# EAGLE design simple (EAGLE 9.0.0)
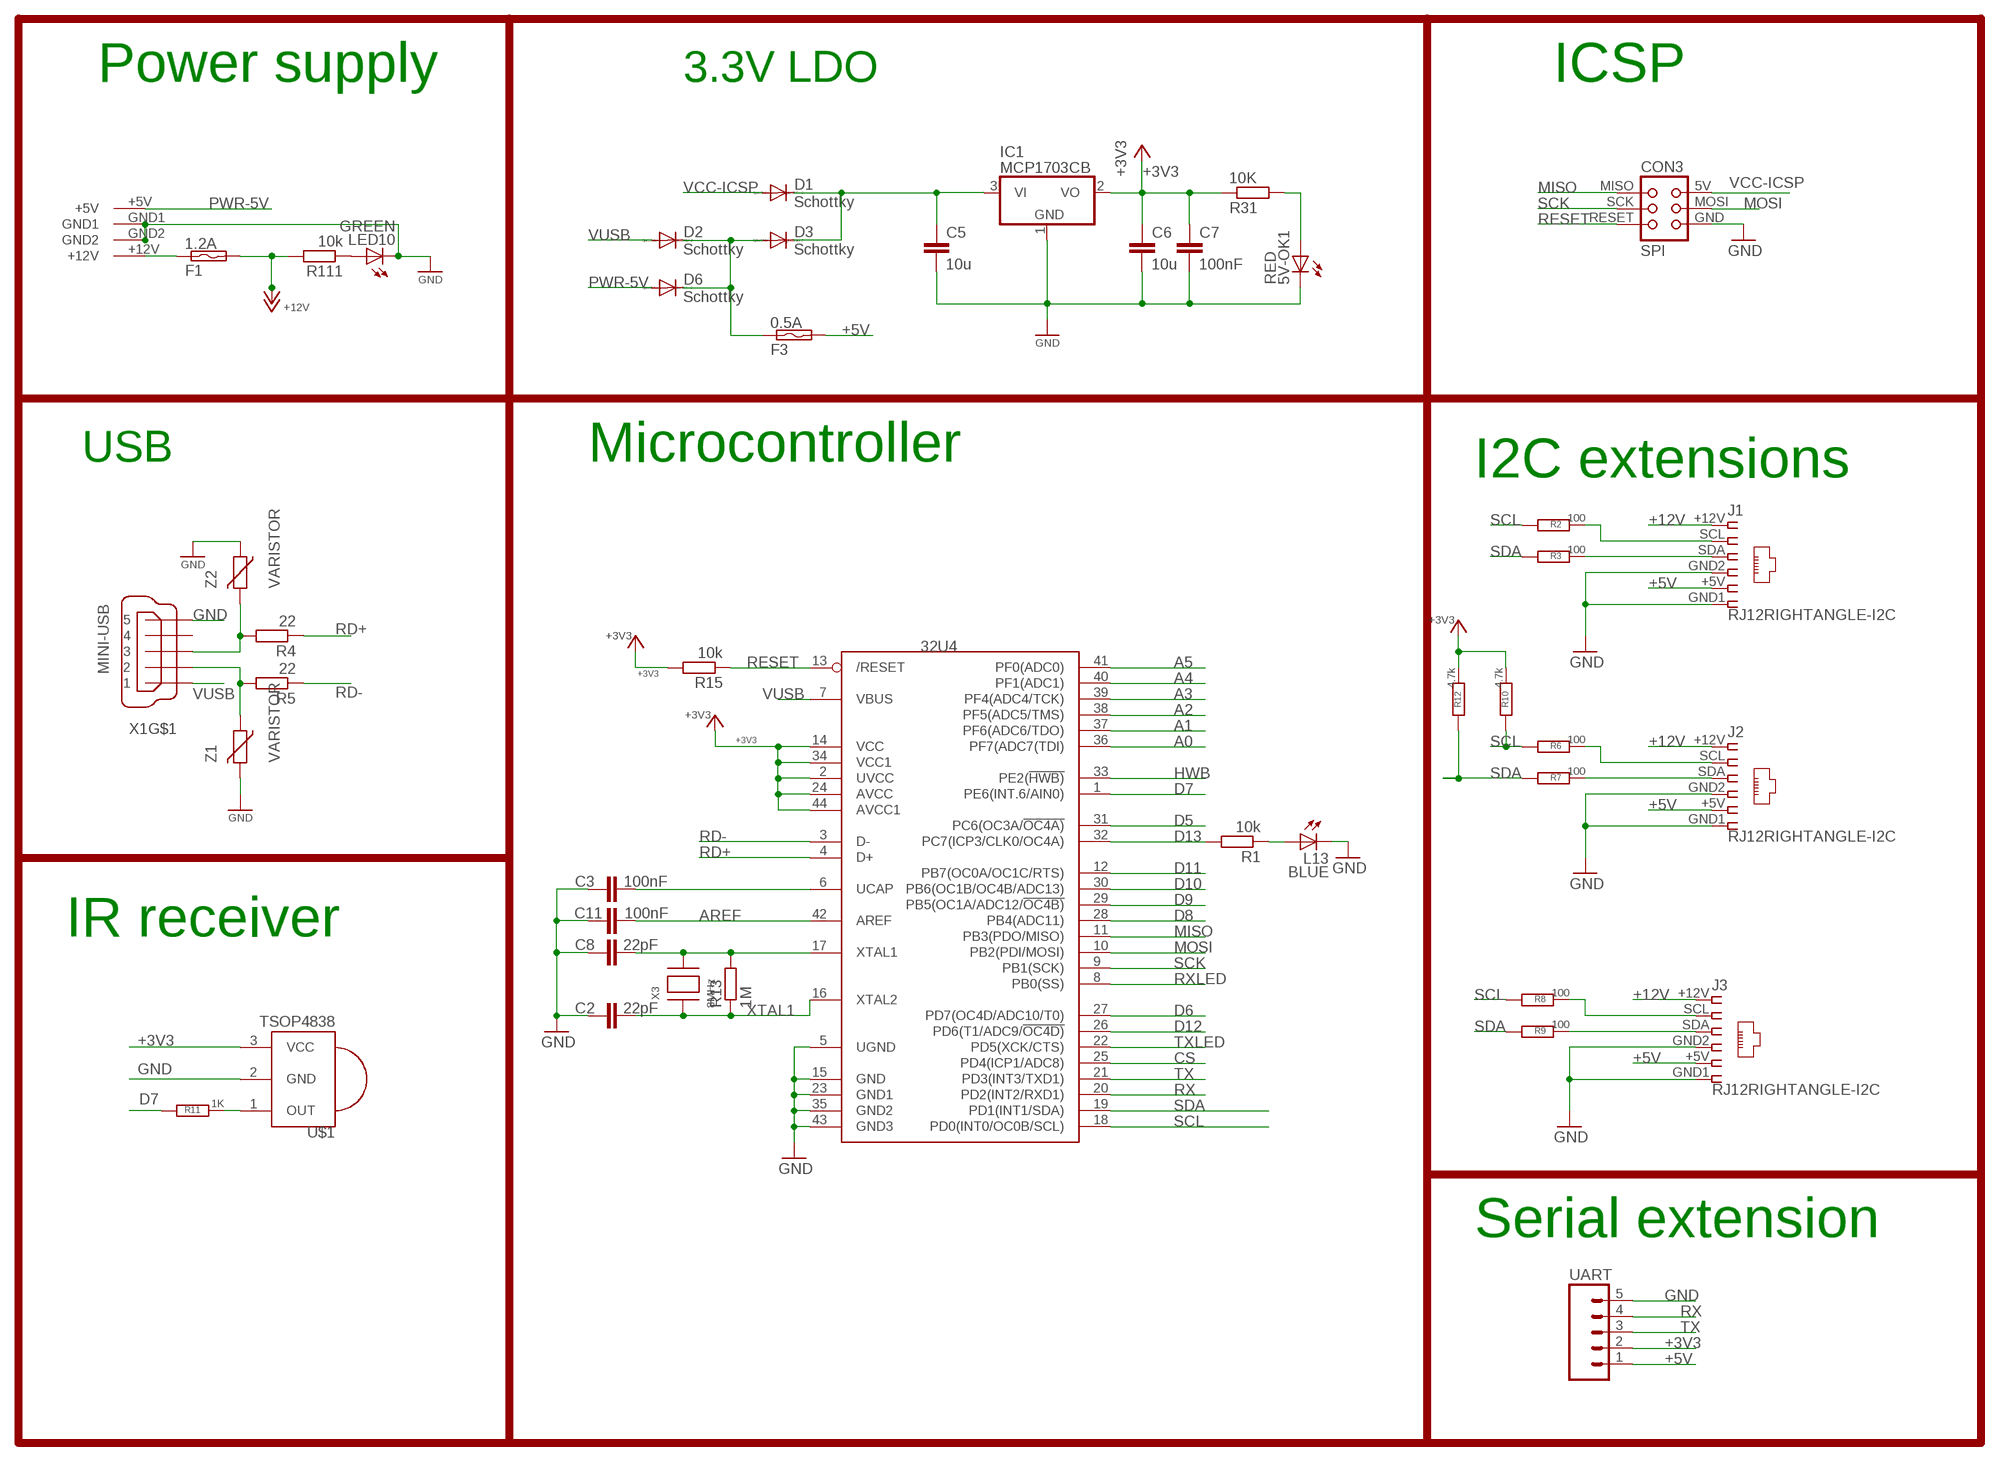
[diagram p0: schematic, sheet 1]

## Parts
5V-OK1  RED  LEDCHIP-LED0805  [CHIP-LED0805]
C2  22pF  C-EUC0805K  [C0805K]
C3  100nF  C-EUC0805K  [C0805K]
C5  10u  C-EUC0805K  [C0805K]
C6  10u  C-EUC0805K  [C0805K]
C7  100nF  C-EUC0805K  [C0805K]
C8  22pF  C-EUC0805K  [C0805K]
C11  100nF  C-EUC0805K  [C0805K]
CON3  SPI  TINYISPT  [TC2030-MCP-NL]
D1  Schottky  MBR0520LT  [SOD123]
D2  Schottky  MBR0520LT  [SOD123]
D3  Schottky  MBR0520LT  [SOD123]
D6  Schottky  MBR0520LT  [SOD123]
F1  1.2A  POLYSWITCHSMD1812  [C1812]
F3  0.5A  POLYSWITCHSMD1812  [C1812]
IC1  MCP1703CB  [SOT23]
J1  RJ12RIGHTANGLE-I2C  [RJ12-RIGHTANGLE-I2C]
J2  RJ12RIGHTANGLE-I2C  [RJ12-RIGHTANGLE-I2C]
J3  RJ12RIGHTANGLE-I2C  [RJ12-RIGHTANGLE-I2C]
L13  BLUE  LEDCHIP-LED0805  [CHIP-LED0805]
LED10  GREEN  LEDCHIP-LED0805  [CHIP-LED0805]
R1  10k  R-EU_M0805  [M0805]
R2  100  R-EU_R0805  [R0805]
R3  100  R-EU_R0805  [R0805]
R4  22  R-EU_R0805  [R0805]
R5  22  R-EU_R0805  [R0805]
R6  100  R-EU_R0805  [R0805]
R7  100  R-EU_R0805  [R0805]
R8  100  R-EU_R0805  [R0805]
R9  100  R-EU_R0805  [R0805]
R10  4.7k  R-EU_R0805  [R0805]
R11  1K  R-EU_R0805  [R0805]
R12  4.7k  R-EU_R0805  [R0805]
R13  1M  R-EU_M0805  [M0805]
R15  10k  R-EU_M0805  [M0805]
R31  10K  R-EU_R0805  [R0805]
R111  10k  R-EU_R0805  [R0805]
U$1  TSOP4838  PNA460XM  [PNA460XM]
U$4  32U4  ATMEGA32U4-AU  [TQFP44]
U$6  KPJX-4S-S  [KPJX-4S-S]
UART  M05PTH  [1X05]
X1  MINI-USB  MINI-USB-SCHIELD-32005-201  [32005-201]
X3  8MHz  XTALNX6035  [NX6035]
Z1  VARISTOR  VARISTORCN0603  [CT/CN0603]
Z2  VARISTOR  VARISTORCN0603  [CT/CN0603]

## Nets
+3V3 [fine]: C6.1 C7.1 IC1.2(VO) R10.1 R12.1 R15.2 R31.1 U$1.3(VCC) U$4.2(UVCC) U$4.14(VCC) U$4.24(AVCC) U$4.34(VCC1) U$4.44(AVCC1) UART.2
+5V [fine]: F3.2 J1.+5V J2.+5V J3.+5V UART.1
+12V [power]: F1.2 J1.+12V J2.+12V J3.+12V R111.2
+XV: C5.1 D1.C D3.C IC1.3(VI)
A0: U$4.36(PF7(ADC7(TDI))
A1: U$4.37(PF6(ADC6/TDO))
A2: U$4.38(PF5(ADC5/TMS))
A3: U$4.39(PF4(ADC4/TCK))
A4: U$4.40(PF1(ADC1))
A5: U$4.41(PF0(ADC0))
AREF: C11.1 U$4.42(AREF)
CS: U$4.25(PD4(ICP1/ADC8))
D5: U$4.31(PC6(OC3A/!OC4A))
D6: U$4.27(PD7(OC4D/ADC10/T0))
D7: R11.2 U$4.1(PE6(INT.6/AIN0))
D8: U$4.28(PB4(ADC11))
D9: U$4.29(PB5(OC1A/ADC12/!OC4B))
D10: U$4.30(PB6(OC1B/OC4B/ADC13))
D11: U$4.12(PB7(OC0A/OC1C/RTS))
D12: U$4.26(PD6(T1/ADC9/!OC4D))
D13: R1.2 U$4.32(PC7(ICP3/CLK0/OC4A))
GND [power]: 5V-OK1.C C2.1 C3.1 C5.2 C6.2 C7.2 C8.1 C11.2 CON3.GND IC1.1(GND) J1.GND1 J1.GND2 J2.GND1 J2.GND2 J3.GND1 J3.GND2 L13.C LED10.C U$1.2(GND) U$4.5(UGND) U$4.15(GND) U$4.23(GND1) U$4.35(GND2) U$4.43(GND3) U$6.GND1 U$6.GND2 UART.5 X1.5 Z1.2 Z2.1
HWB: U$4.33(PE2(!HWB))
MISO: CON3.MISO U$4.11(PB3(PDO/MISO))
MOSI: CON3.MOSI U$4.10(PB2(PDI/MOSI))
N$1: J2.SCL R6.1
N$2: J1.SCL R2.1
N$3: J1.SDA R3.1
N$4: L13.A R1.1
N$5: D2.C D3.A D6.C F3.1
N$6: J2.SDA R7.1
N$7: J3.SCL R8.1
N$8: J3.SDA R9.1
N$9: R11.1 U$1.1(OUT)
N$10: 5V-OK1.A R31.2
N$16: C3.2 U$4.6(UCAP)
N$39: F1.1 U$6.+12V
N$42: C8.2 R13.2 U$4.17(XTAL1) X3.P$2
N$75: LED10.A R111.1
PWR-5V: D6.A U$6.+5V
RD+ [USBB]: R4.1 U$4.4(D+)
RD- [USBB]: R5.1 U$4.3(D-)
RESET: CON3.RESET R15.1 U$4.13(/RESET)
RX: U$4.20(PD2(INT2/RXD1)) UART.4
RXLED: U$4.8(PB0(SS))
SCK: CON3.SCK U$4.9(PB1(SCK))
SCL: R2.2 R6.2 R8.2 R10.2 U$4.18(PD0(INT0/OC0B/SCL))
SDA: R3.2 R7.2 R9.2 R12.2 U$4.19(PD1(INT1/SDA))
TX: U$4.21(PD3(INT3/TXD1)) UART.3
TXLED: U$4.22(PD5(XCK/CTS))
USBC_N: R5.2 X1.2 Z1.1
USBC_P: R4.2 X1.3 Z2.2
VCC-ICSP: CON3.5V(VCC) D1.A
VUSB: D2.A U$4.7(VBUS) X1.1
XTAL1: C2.2 R13.1 U$4.16(XTAL2) X3.P$1
Unconnected: X1.4 X1.M1(S:S1) X1.M2(S:S2) X1.M3(S:S3) X1.M4(S:S4)

## Notes on the sheet
- Power supply | 3.3V LDO | ICSP
- USB | Microcontroller
- I2C extensions
- IR receiver
- Serial extension

## Library data of the parts
5V-OK1 L13 LED10 = adafruit:LED: LED OSRAM: - CHIPLED LG R971, LG N971, LY N971, LG Q971, LY Q971, LO R971, LY R971 LH N974, LH R974 LS Q976, LO Q976, LY Q976 LO Q996 - Hyper CHIPLED LW Q18S LB Q993, LB Q99A, LB R99A - SideLED LS A670, LO A670, LY A670, LG A670, LP A670 LB A673, LV A673, LT A673, LW A673 LH A674 LY A675 LS A676, LA A676, LO A676, LY A676, LW A676 LS A679, LY A679, LG A679 - Hyper Micro SIDELED® LS Y876, LA Y876, LO Y876, LY Y876 LT Y87S - SmartLED LW L88C, LW L88S LB L89C, LB L89S, LG L890 LS L89K, LO L89K, LY L89K LS L896, LA L896, LO L896, LY L896 - TOPLED LS T670, LO T670, LY T670, LG T670, LP T670 LSG T670, LSP T670, LSY T670, LOP T670, LYG T670 LG T671, LOG T671, LSG T671 LB T673, LV T673, LT T673, LW T673 LH T674 LS T676, LA T676, LO T676, LY T676, LB T676, LH T676, LSB T676, LW T676 LB T67C, LV T67C, LT T67C, LS T67K, LO T67K, LY T67K, LW E67C LS E67B, LA E67B, LO E67B, LY E67B, LB E67C, LV E67C, LT E67C LW T67C LS T679, LY T679, LG T679 LS T770, LO T770, LY T770, LG T770, LP T770 LB T773, LV T773, LT T773, LW T773 LH T774 LS E675, LA E675, LY E675, LS T675 LS T776, LA T776, LO T776, LY T776, LB T776 LHGB T686 LT T68C, LB T68C - Hyper Mini TOPLED® LB M676 - Mini TOPLED Santana® LG M470 LS M47K, LO M47K, LY M47K Source: http://www.osram.convergy.de/
C2 C3 C8 C11 = rcl:C-EU: CAPACITOR, European symbol
C5 C6 = rcl:C-EU: CAPACITOR, European symbol; ELECROW: C15850; LCSC: C15850; MPN: 77-VJ1206V106ZXQTBC; SPICEPREFIX: C
C7 = rcl:C-EU: CAPACITOR, European symbol; ELECROW: C49678; LCSC: C49678; MPN: 80-C1206C104K5R; SPICEPREFIX: C
CON3 = lpatiny:TINYISP: CONNECTOR
D1-D3 D6 = diode:MBR0520LT: SCHOTTKY BARRIER RECTIFIER Source: http://onsemi.com .. MBR0520LT1-D.pdf; LCSC: C82544; MPN: 621-1N5819HW-F
F1 F3 = lpatiny:POLYSWITCH: PolySwitch (TM) Resettable Device Source: Data sheet <http://www.farnell.com/datasheets/13482.pdf>
IC1 = linear:MCP1703: 250 mA, 16V, Low Quiescent Current LDO Regulator Source: http://ww1.microchip.com/downloads/en/DeviceDoc/22049b.pdf; LCSC: C53352
J1-J3 = lpatiny:RJ12: CORCOM Modular RJ Jacks No Shield Source: www.tycoelectronics.com .. ENG_DS_1654001_1099_RJ_L_0507.pdf
R1-R3 R6-R12 R15 R31 = resistor:R-EU_: RESISTOR, European symbol
R4 = rcl:R-EU_: RESISTOR, European symbol; ELECROW: C17561; LCSC: C17561
R5 = rcl:R-EU_: RESISTOR, European symbol; ELECROW: C17561; LCSC: C17561; SPICEPREFIX: R
R13 R111 = rcl:R-EU_: RESISTOR, European symbol
U$1 = adafruit:PNA460XM: IR 38KHz receiver PNA4602 and related receivers http://www.ladyada.net/library/pcb/eaglelibrary.html
U$4 = adafruit:ATMEGA32U4: http://www.ladyada.net/library/eagle
U$6 = lpatiny:KPJX-4S-S
UART = SparkFun-Connectors:M05: Header 5 Standard 5-pin 0.1" header. Use with straight break away headers (SKU : PRT-00116), right angle break away headers (PRT-00553), swiss pins (PRT-00743), machine pins (PRT-00117), and female headers (PRT-00115). Molex polarized connector foot print use with SKU : PRT-08230 with associated crimp pins and housings.
X1 = con-cypressindustries:MINI-USB-SCHIELD-: MINI USB-B Conector Source: www.cypressindustries.com; LCSC: C46391; MPN: 649-10033526-N3212LF
X3 = lpatiny:XTAL: Low cost SMT crystals, no capacitors included http://www.ladyada.net/library/eagle
Z1 Z2 = varistor:VARISTOR: VARISTOR

## Net classes
0 default: width 0.406 mm, clearance 0.25 mm
1 power: width 0.254 mm
2 VIN: width 0.254 mm
3 fine: width 0.254 mm
4 aref: width 0.254 mm
5 USBA: width 0.254 mm, clearance 0.254 mm
6 USBB: width 0.254 mm, clearance 0.254 mm

## Board
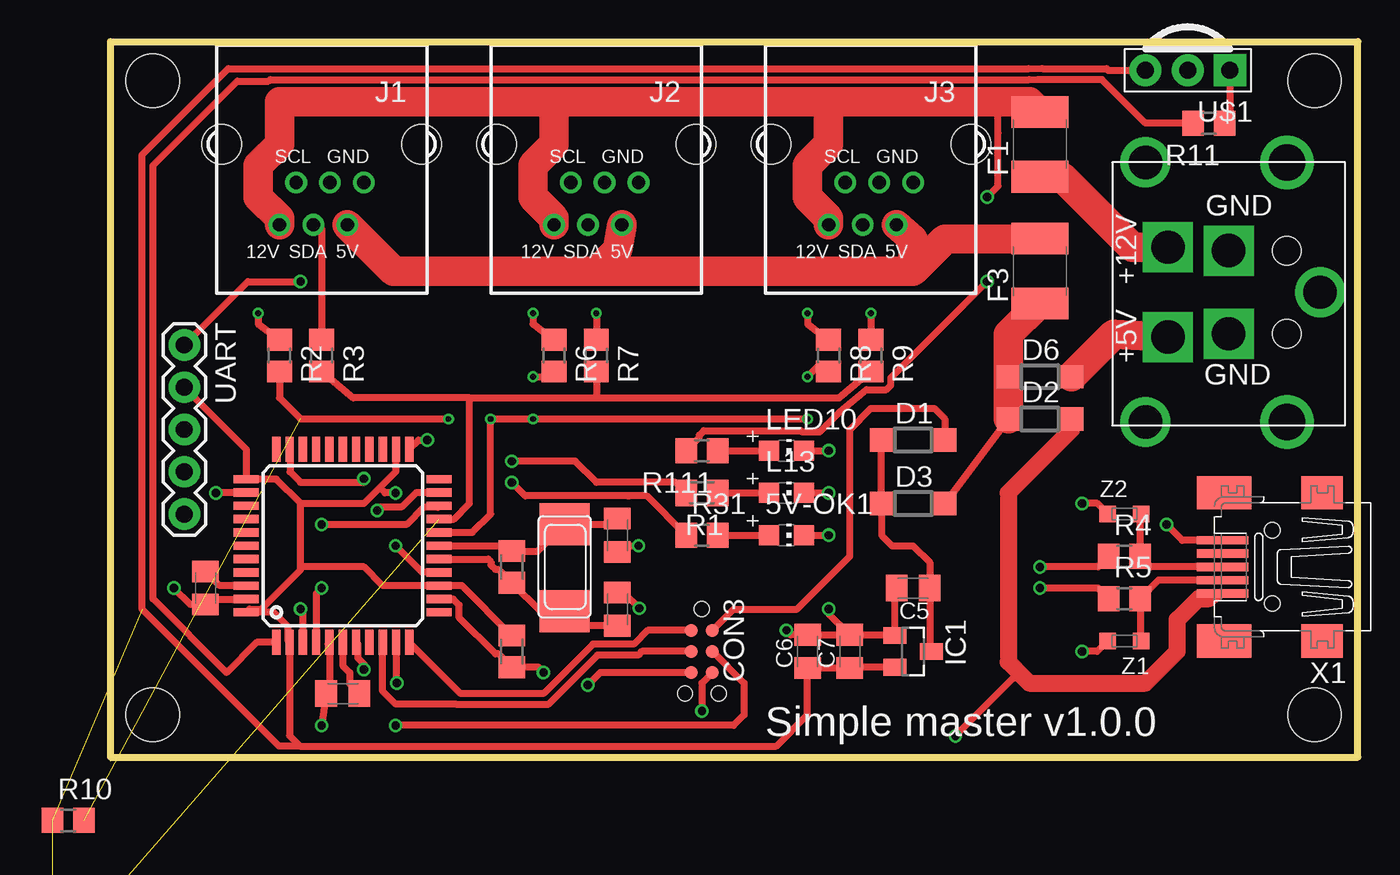
[diagram p1: board, top side]
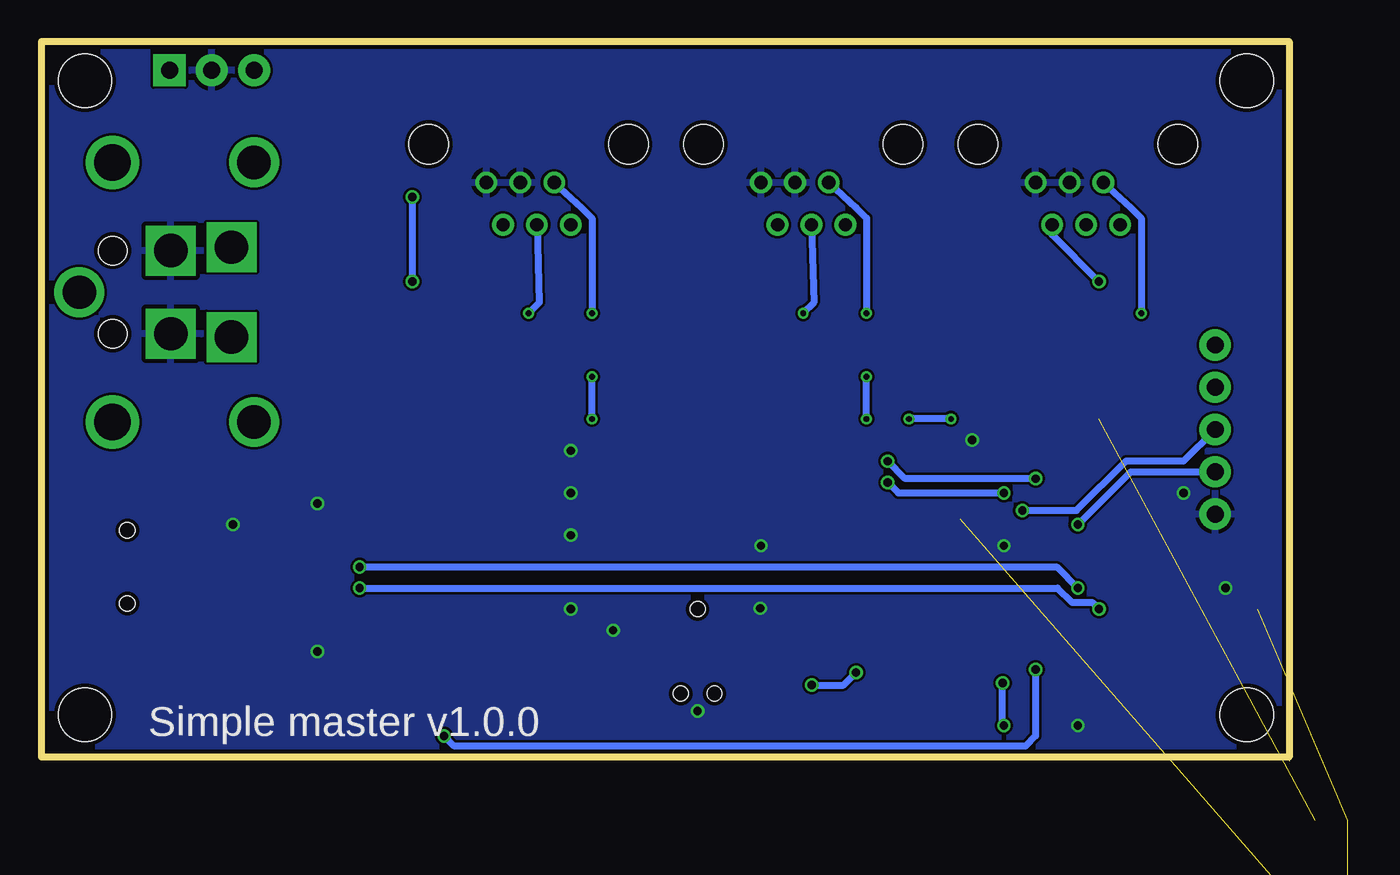
[diagram p2: board, bottom side, seen from below]

Size 75 x 43.25 mm. Coordinates in mm from the lower left corner, seen from the top.
Outline: 0,0.25 0,0
Outline: 0,0.25 75,0.25 75,43.25 0,43.25 0,0.25
Copper layers (1*16): Top 0.035mm / dielectric 1.5mm / Bottom 0.035mm
Design rules "Fusion_eagle_rule_v1.1": minimum track width 6mil, minimum drill 12mil, track to track 6mil, track to pad 6mil, pad to pad 6mil, via to via 6mil, smd to smd 0mil, copper to edge 10mil, drill to drill 10mil, minimum pad ring 10mil, minimum via ring 6mil, stop-mask expansion 2mil, vias tented up to drill 100mil, thermal gap 10mil
Holes 3.2 mm at 2.54,2.79 2.54,40.89 72.39,40.89 72.39,2.79

### Footprints (pad centres in the part's own frame; a part is rotated, then mirrored left to right if it is on the bottom)
CHIP-LED0805 = smd 1.2 x 1.2: A 0,-1.05; C 0,1.05
C0805K = smd 1.3 x 1.6: 1 -1,0; 2 1,0
TC2030-MCP-NL = smd 0.787 x 0.787: 5V 1.27,0.635; GND 3.81,0.635; MISO 1.27,-0.635; MOSI 2.54,0.635; RESET 3.81,-0.635; SCK 2.54,-0.635 | hole 0.889: 0,0; 5.08,-1.016; 5.08,1.016
SOD123 = smd 1.4 x 1.4: A 1.9,0; C -1.9,0
C1812 = smd 1.9 x 3.4: 1 -1.95,0; 2 1.95,0
SOT23 = smd 1 x 1.4: 1 -0.95,-1.1; 2 0.95,-1.1; 3 0,1.1
RJ12-RIGHTANGLE-I2C = drill 0.8 pad 1.3: +5V -1.54,4.84; +12V 2.54,4.84; GND1 -2.54,2.3; GND2 -0.5,2.3; SCL 1.54,2.3; SDA 0.5,4.84 | hole 2.36: -6,0; 6,0
M0805 = smd 1.3 x 1.6: 1 -0.95,0; 2 0.95,0
R0805 = smd 1.3 x 1.5: 1 -0.95,0; 2 0.95,0
PNA460XM = drill 1.016 pad 1.93 square: 1 -2.54,0 | drill 1.016 pad 1.93: 2 0,0; 3 2.54,0
TQFP44 = smd 1.5 x 0.5: 1 -5.8,4; 2 -5.8,3.2; 3 -5.8,2.4; 4 -5.8,1.6; 5 -5.8,0.8; 6 -5.8,0; 7 -5.8,-0.8; 8 -5.8,-1.6; 9 -5.8,-2.4; 10 -5.8,-3.2; 11 -5.8,-4; 23 5.8,-4; 24 5.8,-3.2; 25 5.8,-2.4; 26 5.8,-1.6; 27 5.8,-0.8; 28 5.8,0; 29 5.8,0.8; 30 5.8,1.6; 31 5.8,2.4; 32 5.8,3.2; 33 5.8,4 | smd 0.5 x 1.5: 12 -4,-5.8; 13 -3.2,-5.8; 14 -2.4,-5.8; 15 -1.6,-5.8; 16 -0.8,-5.8; 17 0,-5.8; 18 0.8,-5.8; 19 1.6,-5.8; 20 2.4,-5.8; 21 3.2,-5.8; 22 4,-5.8; 34 4,5.8; 35 3.2,5.8; 36 2.4,5.8; 37 1.6,5.8; 38 0.8,5.8; 39 0,5.8; 40 -0.8,5.8; 41 -1.6,5.8; 42 -2.4,5.8; 43 -3.2,5.8; 44 -4,5.8
KPJX-4S-S = drill 2 square: +5V 2.7,1.35; +12V -2.7,1.35; GND1 -2.5,5; GND2 2.5,5 | drill 2: P$1 -7.8,0; P$2 7.8,0; P$11 0,10.5 | drill 2.2: P$3 -7.8,8.5; P$4 7.8,8.5 | hole 1.7: -2.5,8.5; 2.5,8.5
1X05 = drill 1.016 pad 1.88: 1 0,0; 2 2.54,0; 3 5.08,0; 4 7.62,0; 5 10.16,0
32005-201 = smd 3.1 x 0.5: 1 3,1.6; 2 3,0.8; 3 3,0; 4 3,-0.8; 5 3,-1.6 | smd 2.5 x 2: M1 -3,-4.45; M2 -3,4.45 | smd 3.3 x 2: M3 2.9,4.45; M4 2.9,-4.45 | hole 0.9: 0,2.2; 0,-2.2
NX6035 = smd 2.5 x 3: P$1 2.665,0; P$2 -2.565,0
CT/CN0603 = smd 1 x 1: 1 -1,0; 2 1,0

### Placement (x,y rotation side)
5V-OK1  40.64,13.59 270 top
C2  30.48,9.14 270 top
C3  13.97,4.06 0 top
C5  48.26,10.41 180 top
C6  41.91,6.6 90 top
C7  44.45,6.6 90 top
C8  30.48,13.59 90 top
C11  5.71,10.41 270 top
CON3  35.56,9.14 270 top
D1  48.26,19.3 0 top
D2  55.88,20.57 0 top
D3  48.26,15.49 0 top
D6  55.88,23.11 0 top
F1  55.88,37.08 90 top
F3  55.88,29.46 90 top
IC1  48.26,6.6 270 top
J1  12.7,37.08 180 top
J2  29.21,37.08 180 top
J3  45.72,37.08 180 top
L13  40.64,16.13 270 top
LED10  40.64,18.67 270 top
R1  35.56,16.13 180 top
R2  10.16,24.38 270 top
R3  12.7,24.38 270 top
R4  60.96,12.32 0 top
R5  60.96,9.78 0 top
R6  26.67,24.38 270 top
R7  29.21,24.38 270 top
R8  43.18,24.38 270 top
R9  45.72,24.38 270 top
R10  -2.54,-3.56 0 top  (outside the outline)
R11  66.04,38.35 180 top
R12  -2.54,-9.91 0 top  (outside the outline)
R13  24.13,11.68 90 top
R15  24.13,6.6 90 top
R31  35.56,13.59 0 top
R111  35.56,18.67 180 top
U$1  64.77,41.53 180 top
U$4  13.97,12.95 90 top
U$6  62.23,28.19 270 top
UART  4.45,25.02 270 top
X1  69.85,11.68 180 top
X3  27.3,11.68 270 top
Z1  60.96,7.24 180 top
Z2  60.96,14.86 0 top

### Tracks (layer width: path | path; a pad name or v marks a point on that pad's centre or on a via)
+3V3  (via drill 0.5)  (2 unrouted)
  Top 0.406: IC1.2 44.5,5.65 C7.1 C6.1 41.91,2.79 40.03,0.91 11.4,0.91 | R15.2 21.13,10.55 U$4.14 16.37,10.55 15.24,11.68 11.43,11.68 | 11.43,15.49 9.97,16.95 U$4.34 8.17,18.75 UART.2 | 11.43,11.68 11.43,11.51 9.07,9.15 8.36,9.15 U$4.44 9.81,8.95 10.67,8.09 10.67,7.25 U$4.2 10.77,1.55 11.4,0.91 | 11.43,11.68 11.43,15.49 | 11.43,15.49 15.24,15.49 16.19,16.45 | 16.19,16.45 17.17,17.42 U$4.24 | 11.4,0.91 10.13,0.91 1.91,9.14 1.91,36.45 7.08,41.62 55.21,41.62 56,41.65 56.03,41.62 59.89,41.62 59.98,41.53 U$1.3 | v24.13,16.76 24.94,15.95 31.11,15.95 | 31.21,15.95 31.11,15.95 | v17.14,16.13 16.51,16.13 16.19,16.45 | R31.1 32.25,15.95 31.11,15.95
  Bottom 0.406: v24.13,16.76 23.5,16.13 19.68,16.13 v17.14,16.13
+5V  (via drill 0.5)
  Top 0.406: UART.1 8.26,28.83 v11.43,28.83
  Top 1.778: 29.21,29.46 30.48,30.73 J2.+5V | J3.+5V 48.26,31.37 48.26,29.46 | 48.26,29.46 29.21,29.46 | 48.26,29.46 50.16,31.37 F3.2 | J1.+5V 17.02,29.46 29.21,29.46
  Bottom 0.406: v11.43,28.83 14.24,31.64 J1.+5V
+12V  (via drill 0.5)
  Top 0.406: R111.2 35.41,19.47 35.41,19.61 35.67,19.87 41.51,19.87 41.59,19.79 42.65,19.79 43.85,20.99 45.46,22.33 46.66,22.33 46.92,22.6 46.92,23.05 v52.7,28.83 | 53.34,39.62 53.34,37.78 53.36,37.76 53.36,34.56 v52.7,33.91
  Top 1.778: J1.+12V 10.16,32.64 8.89,33.91 8.89,35.81 10.16,37.08 10.16,39.62 26.67,39.62 | 26.67,39.62 43.18,39.62 | 43.18,39.62 53.34,39.62 55.24,39.62 F1.2 | J2.+12V 26.67,32.64 25.4,33.91 25.4,35.81 26.67,37.08 26.67,39.62 | J3.+12V 43.18,32.64 41.91,33.91 41.91,35.81 43.18,37.08 43.18,39.62
  Bottom 0.406: v52.7,28.83 v52.7,33.91
+XV
  Top 0.406: IC1.3 49.26,6.7 C5.1 49.26,11.95 48.26,12.95 46.99,12.95 46.35,13.59 D3.C D1.C
AREF
  Top 0.406: U$4.42 6.58,10.55 C11.1
D7
  Top 0.406: U$4.1 8.8,7.15 6.99,5.33 2.56,9.76 2.56,35.81 7.62,40.87 | 7.62,40.87 7.62,40.89 | 7.62,40.87 9.51,40.87 9.6,40.97 55.22,40.97 55.75,40.99 55.77,40.97 59.62,40.97 62.23,38.35 R11.2
D13  (via drill 0.5)
  Top 0.406: U$4.32 10.79,18.73 10.79,17.4 11.43,16.76 15.24,16.76 v15.24,16.99 | R1.2 33.98,16.76 29.21,16.76 27.94,18.03 v24.13,18.03
  Bottom 0.406: v15.24,16.99 23.08,16.99 v24.13,18.03
GND  (via drill 0.5)
  Top 0.406: X1.5 64.44,13.28 v63.5,14.22 | Z2.1 59.33,15.49 v58.42,15.49 | Z1.2 59.33,6.6 v58.42,6.6 | 13.08,7.06 U$4.5 13.17,4.26 C3.1 v12.7,2.16 | U$4.43 6.05,9.75 C11.2 4.81,9.41 v3.81,10.41 | C2.1 30.85,10.14 v31.8,9.2 | C8.1 30.84,12.95 v31.75,12.95 | C7.2 C6.2 40.91,7.6 v40.64,7.87 | C7.2 47.11,7.6 IC1.1 47.16,10.31 C5.2 | C7.2 43.18,8.87 v43.18,9.14 | CON3.GND 35.56,4.7 v35.56,3.02 | 5V-OK1.C v43.18,13.59 | LED10.C v43.18,18.67 | L13.C v43.18,16.13 | U$4.15 18.75,11.35 v17.14,12.95 | U$4.23 18.52,19.3 v19.05,19.3 | U$4.35 6.38,16.15 v6.35,16.13
  pour Bottom: 0,0.25 0,42.8 74.93,42.8 74.93,0.25
MISO
  Top 0.406: U$4.11 21.06,4.06 26.04,4.06 29.01,7.04 31.47,7.04 32.3,7.87 CON3.MISO
MOSI  (via drill 0.5)
  Top 0.406: CON3.MOSI 38.1,4.7 38.1,2.79 37.47,2.16 v17.14,2.16 | U$4.10 17.17,4.76 v17.23,4.7
  Bottom 0.406: v17.14,2.16 17.23,2.24 v17.23,4.7
N$1  (via drill 0.35)
  Top 0.406: v25.4,26.92 25.4,26.29 R6.1
  Bottom 0.406: J2.SCL 26.04,33.27 25.4,32.64 v25.4,26.92
N$2  (via drill 0.35)
  Top 0.406: v8.89,26.92 8.89,26.29 R2.1
  Bottom 0.406: J1.SCL 9.53,33.27 8.89,32.64 v8.89,26.92
N$3
  Top 0.406: J1.SDA 12.7,32 R3.1
N$4
  Top 0.406: R1.1 L13.A
N$5
  Top 0.406: D2.C D3.A
  Top 1.778: F3.1 53.98,25.65 D6.C D2.C
N$6  (via drill 0.35)
  Top 0.406: v29.21,26.92 R7.1
  Bottom 0.406: J2.SDA 28.57,27.56 v29.21,26.92
N$7  (via drill 0.35)
  Top 0.406: v41.91,26.92 41.91,26.29 R8.1
  Bottom 0.406: J3.SCL 42.55,33.27 41.91,32.64 v41.91,26.92
N$8  (via drill 0.35)
  Top 0.406: v45.72,26.92 R9.1
  Bottom 0.406: J3.SDA 45.09,27.56 v45.72,26.92
N$9
  Top 0.406: U$1.1 67.31,38.67 R11.1
N$10
  Top 0.406: R31.2 5V-OK1.A
N$16
  Top 0.406: C3.2 14.38,4.65 14.38,5.33 13.97,5.75 U$4.6
N$39
  Top 1.778: F1.1 57.2,35.13 61.44,30.89 U$6.+12V
N$42
  Top 0.406: U$4.17 23.81,12.95 R13.2 25.69,12.63 X3.P$2 30.14,14.25 C8.2
N$75
  Top 0.406: R111.1 LED10.A
PWR-5V
  Top 1.778: D6.A 60.33,25.65 U$6.+5V
RD+  (via drill 0.5)
  Top 0.406: R4.1 59.38,11.68 v55.88,11.68 | v12.7,10.41 12.37,10.08 U$4.4
  Bottom 0.406: v55.88,11.68 13.97,11.68 v12.7,10.41
RD-  (via drill 0.5)
  Top 0.406: R5.1 59.38,10.41 v55.88,10.41 | v11.43,9.14 11.57,9 U$4.3
  Bottom 0.406: v11.43,9.14 11.84,9.55 13.06,9.55 13.92,10.41 v55.88,10.41
RESET  (via drill 0.5)
  Top 0.406: U$4.13 20.61,9.75 20.97,9.39 20.97,8.62 23.14,6.45 23.33,6.45 R15.1 25.71,5.65 v26.04,5.33 | CON3.RESET 29.44,5.33 v28.69,4.58
  Bottom 0.406: v28.69,4.58 26.79,4.58 v26.04,5.33
RX  (via drill 0.5)
  Top 0.406: U$4.20 19.67,15.26 18.83,15.26 17.8,14.22 v12.7,14.22
  Bottom 0.406: v12.7,14.22 9.53,17.4 UART.4
SCK
  Top 0.406: U$4.9 16.37,4.2 17.14,3.43 20.77,3.43 20.79,3.41 26.31,3.41 29.28,6.38 31.74,6.38 31.96,6.6 CON3.SCK
SCL  (via drill 0.35)  (1 unrouted)
  Top 0.406: R2.2 10.16,21.84 11.43,20.57 v20.32,20.57 | v25.4,23.11 26.04,23.11 R6.2 | v41.91,20.57 v25.4,20.57 v22.86,20.57 22.86,14.86 21.75,13.75 U$4.18 | v41.91,23.11 42.55,23.75 R8.2
  Bottom 0.406: v20.32,20.57 v22.86,20.57 | v25.4,20.57 v25.4,23.11 | v41.91,20.57 v41.91,23.11
SDA  (1 unrouted)
  Top 0.406: 21.59,21.84 21.59,15.49 20.65,14.55 U$4.19 | 21.59,21.84 14.61,21.84 R3.2 | 21.59,21.84 29.21,21.84 | 29.21,21.84 43.81,21.84 R9.2 | R7.2 29.21,21.84
TX  (via drill 0.5)
  Top 0.406: U$4.21 18.38,16.15 17.5,15.27 16.23,15.27 v16.04,15.08
  Bottom 0.406: v16.04,15.08 12.77,15.08 9.8,18.05 6.33,18.05 UART.3
USBC_N
  Top 0.406: X1.2 63.02,10.88 R5.2 61.91,7.29 Z1.1
USBC_P
  Top 0.406: X1.3 62.55,11.68 R4.2 61.91,14.81 Z2.2
VCC-ICSP
  Top 0.406: CON3.5V 37.47,9.14 41.27,9.14 44.45,12.32 44.45,19.94 45.72,21.21 49.53,21.21 50.16,20.57 D1.A
VUSB  (via drill 0.5)
  Top 0.406: 66.04,9.78 66.55,9.78 X1.1 | U$4.7 14.87,7.06 14.87,6.22 15.24,5.84 v15.24,5.52 | v50.8,1.52 54.29,5.02 54.93,5.02
  Top 1.016: D2.A 57.78,19.93 53.98,16.13 53.98,5.97 54.93,5.02 55.24,4.7 62.23,4.7 64.14,6.6 64.14,8.51 65.41,9.78 66.04,9.78
  Bottom 0.406: v15.24,5.52 15.24,1.52 15.85,0.91 50.19,0.91 v50.8,1.52
XTAL1
  Top 0.406: U$4.16 22.71,12.15 22.88,11.99 22.88,11.8 23.14,11.53 23.33,11.53 R13.1 25.84,9.02 26.67,9.02 | 26.67,9.02 X3.P$1 | C2.2 27.55,8.14 26.67,9.02

### Text on the board
tPlace: Simple master v1.0.0
bPlace: Simple master v1.0.0
203bmp: C:/Users/G/Pictures/logo_epfl.bmp